# EAGLE design OBCI32_HC05 (EAGLE 7.4.0)
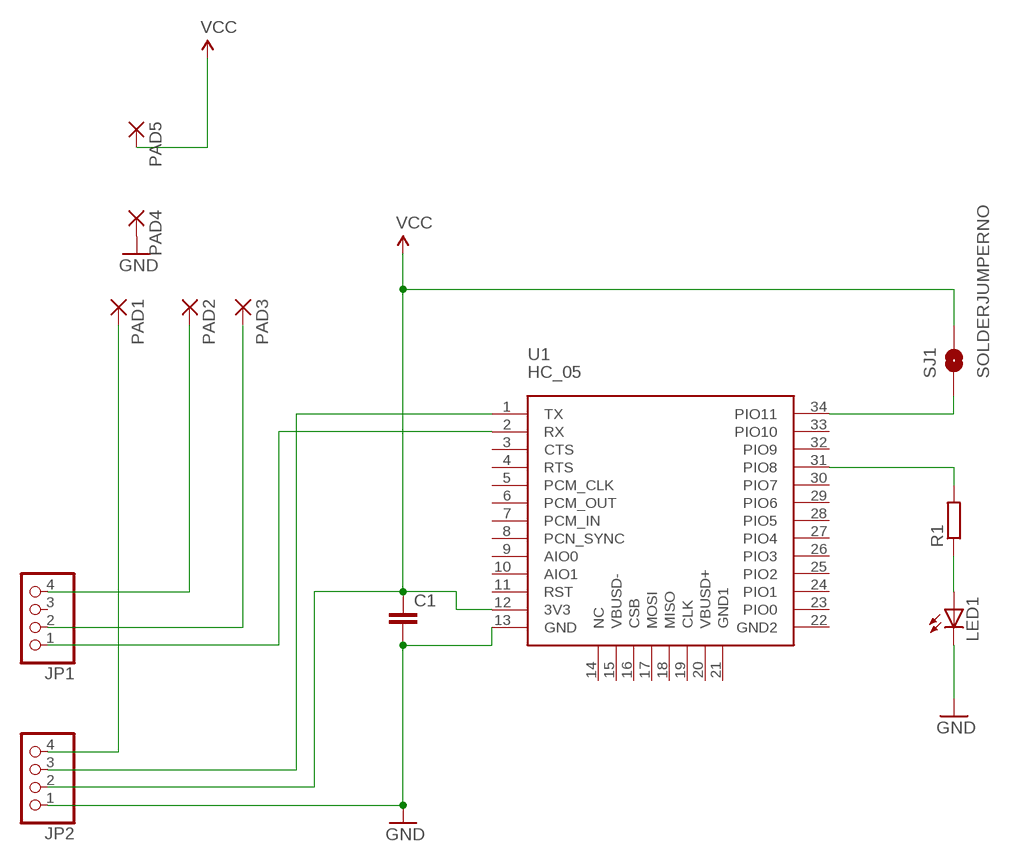
[diagram p0: schematic, sheet 1]

## Parts
C1  C-EUC0805  [C0805]
JP1  PINHD-1X4  [1X04]
JP2  PINHD-1X4  [1X04]
LED1  LEDCHIP-LED0805  [CHIP-LED0805]
PAD1  SMD2  [SMD1,27-2,54]
PAD2  SMD2  [SMD1,27-2,54]
PAD3  SMD2  [SMD1,27-2,54]
PAD4  SMD2  [SMD1,27-2,54]
PAD5  SMD2  [SMD1,27-2,54]
R1  R-EU_R0603  [R0603]
SJ1  SOLDERJUMPERNO  [SJ_2S-NO]
U1  HC_05  [BLUETOOTH_SMD]

## Nets
GND: C1.2 JP2.1 LED1.C PAD4.1(P) U1.13(GND)
N$1: LED1.A R1.1
N$3: JP2.3 U1.1(TX)
N$4: JP1.1 U1.2(RX)
N$5: R1.2 U1.31(PIO8)
N$6: SJ1.1 U1.34(PIO11)
N$7: JP1.2 PAD3.1(P)
N$8: JP1.4 PAD2.1(P)
N$9: JP2.4 PAD1.1(P)
VCC: C1.1 JP2.2 PAD5.1(P) SJ1.2 U1.12(3V3)
Unconnected: JP1.3 U1.3(CTS) U1.4(RTS) U1.5(PCM_CLK) U1.6(PCM_OUT) U1.7(PCM_IN) U1.8(PCN_SYNC) U1.9(AIO0) U1.10(AIO1) U1.11(RST) U1.14(NC) U1.15(VBUSD-) U1.16(CSB) U1.17(MOSI) U1.18(MISO) U1.19(CLK) U1.20(VBUSD+) U1.21(GND1) U1.22(GND2) U1.23(PIO0) U1.24(PIO1) U1.25(PIO2) U1.26(PIO3) U1.27(PIO4) U1.28(PIO5) U1.29(PIO6) U1.30(PIO7) U1.32(PIO9) U1.33(PIO10)

## Library data of the parts
C1 = rcl:C-EU: CAPACITOR, European symbol
JP1 JP2 = pinhead:PINHD-1X4: PIN HEADER
LED1 = adafruit:LED: LED OSRAM: - CHIPLED LG R971, LG N971, LY N971, LG Q971, LY Q971, LO R971, LY R971 LH N974, LH R974 LS Q976, LO Q976, LY Q976 LO Q996 - Hyper CHIPLED LW Q18S LB Q993, LB Q99A, LB R99A - SideLED LS A670, LO A670, LY A670, LG A670, LP A670 LB A673, LV A673, LT A673, LW A673 LH A674 LY A675 LS A676, LA A676, LO A676, LY A676, LW A676 LS A679, LY A679, LG A679 - Hyper Micro SIDELED® LS Y876, LA Y876, LO Y876, LY Y876 LT Y87S - SmartLED LW L88C, LW L88S LB L89C, LB L89S, LG L890 LS L89K, LO L89K, LY L89K LS L896, LA L896, LO L896, LY L896 - TOPLED LS T670, LO T670, LY T670, LG T670, LP T670 LSG T670, LSP T670, LSY T670, LOP T670, LYG T670 LG T671, LOG T671, LSG T671 LB T673, LV T673, LT T673, LW T673 LH T674 LS T676, LA T676, LO T676, LY T676, LB T676, LH T676, LSB T676, LW T676 LB T67C, LV T67C, LT T67C, LS T67K, LO T67K, LY T67K, LW E67C LS E67B, LA E67B, LO E67B, LY E67B, LB E67C, LV E67C, LT E67C LW T67C LS T679, LY T679, LG T679 LS T770, LO T770, LY T770, LG T770, LP T770 LB T773, LV T773, LT T773, LW T773 LH T774 LS E675, LA E675, LY E675, LS T675 LS T776, LA T776, LO T776, LY T776, LB T776 LHGB T686 LT T68C, LB T68C - Hyper Mini TOPLED® LB M676 - Mini TOPLED Santana® LG M470 LS M47K, LO M47K, LY M47K Source: http://www.osram.convergy.de/
PAD1-PAD5 = wirepad:SMD2: SMD PAD
R1 = rcl:R-EU_: RESISTOR, European symbol
SJ1 = SparkFun-Retired:SOLDERJUMPER: Solder Jumper Standard SMD solder jumper. Used to automate production. Two varients : Normally Open and Normally Closed are the same, but have different paste layers. NC will have a large amount of paste and should jumper during reflow.
U1 = SerialPortBluetooth:HC_05

## Board
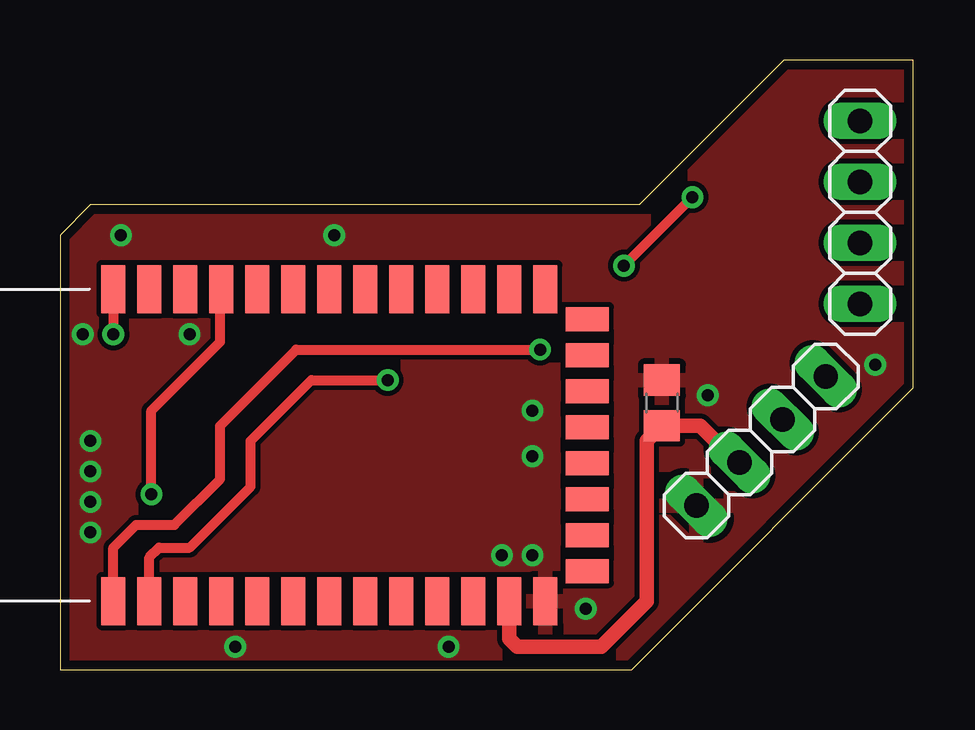
[diagram p1: board, top side]
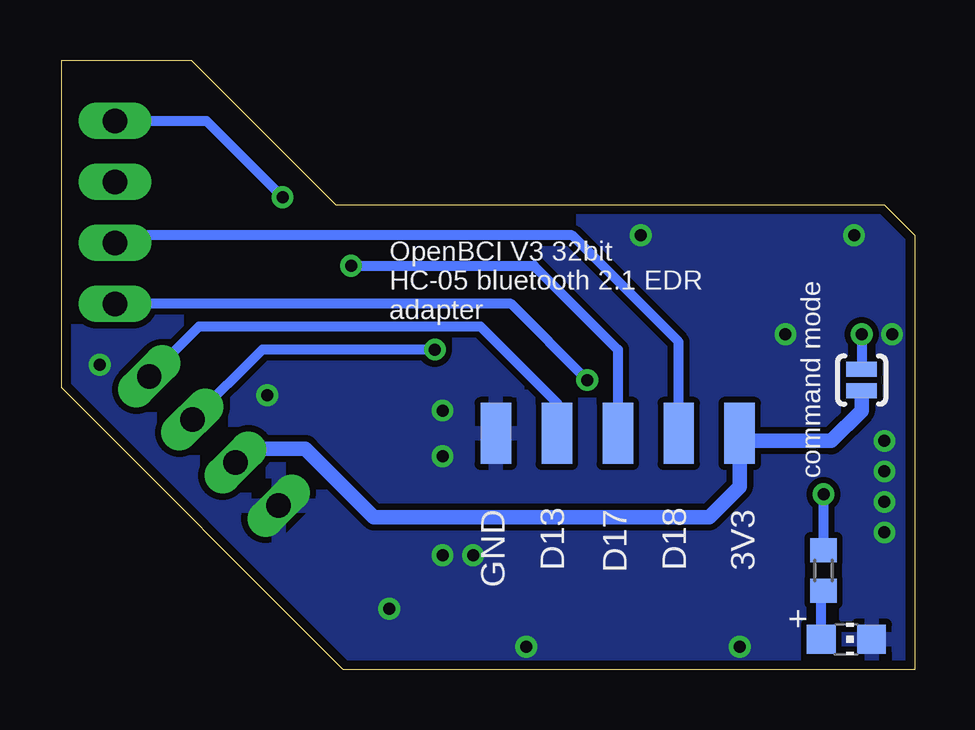
[diagram p2: board, bottom side, seen from below]

Size 35.56 x 25.4 mm. Coordinates in mm from the lower left corner, seen from the top.
Outline: 0,0 23.81,0 35.56,11.75 35.56,25.4 30.16,25.4 24.13,19.37 1.27,19.37 0,18.1 0,0
Copper layers (1*16): Top 0.035mm / dielectric 1.5mm / Bottom 0.035mm
Design rules "default *": minimum track width 10mil, minimum drill 24mil, track to track 8mil, track to pad 8mil, pad to pad 8mil, via to via 8mil, smd to smd 8mil, copper to edge 15mil, drill to drill 8mil, minimum pad ring 10mil, minimum via ring 8mil, stop-mask expansion 4mil, vias tented up to drill 20mil, thermal gap 10mil

### Footprints (pad centres in the part's own frame; a part is rotated, then mirrored left to right if it is on the bottom)
C0805 = smd 1.3 x 1.5: 1 -0.95,0; 2 0.95,0
1X04 = drill 1.016 long: 1 -3.81,0; 2 -1.27,0; 3 1.27,0; 4 3.81,0
CHIP-LED0805 = smd 1.2 x 1.2: A 0,-1.05; C 0,1.05
SMD1,27-2,54 = smd 1.27 x 2.54: 1 0,0
R0603 = smd 1 x 1.1: 1 -0.85,0; 2 0.85,0
SJ_2S-NO = smd 0.635 x 1.27: 1 -0.45,0; 2 0.45,0
BLUETOOTH_SMD = smd 2 x 1: 1 0,0; 2 0,-1.5; 3 0,-3; 4 0,-4.5; 5 0,-6; 6 0,-7.5; 7 0,-9; 8 0,-10.5; 9 0,-12; 10 0,-13.5; 11 0,-15; 12 0,-16.5; 13 0,-18; 22 13,-18; 23 13,-16.5; 24 13,-15; 25 13,-13.5; 26 13,-12; 27 13,-10.5; 28 13,-9; 29 13,-7.5; 30 13,-6; 31 13,-4.5; 32 13,-3; 33 13,-1.5; 34 13,0 | smd 1 x 1.8: 14 1.25,-19.75; 15 2.75,-19.75; 16 4.25,-19.75; 17 5.75,-19.75; 18 7.25,-19.75; 19 8.75,-19.75; 20 10.25,-19.75; 21 11.75,-19.75

### Placement (x,y rotation side)
C1  25.08,11.11 90 top
JP1  33.34,19.05 90 top
JP2  29.21,9.53 45 top
LED1  2.86,1.27 270 bottom
PAD1  14.92,9.84 0 bottom
PAD2  12.38,9.84 0 bottom
PAD3  9.84,9.84 0 bottom
PAD4  17.46,9.84 0 bottom
PAD5  7.3,9.84 0 bottom
R1  3.81,4.13 90 bottom
SJ1  2.22,12.07 270 bottom
U1  2.22,2.86 90 top

### Tracks (layer width: path | path; a pad name or v marks a point on that pad's centre or on a via)
GND  (via drill 0.5)
  other vias: 1.27,6.98 1.27,5.71 1.27,8.25 1.27,9.53 0.95,13.97 2.54,18.1 11.43,18.1 7.3,0.95 16.19,0.95 21.91,2.54 19.68,4.76 18.41,4.76 19.68,10.8 19.68,8.89 33.97,12.7 26.99,11.43 5.4,13.97
  pour Top: -0.32,27.94 -0.32,-5.08 40.96,-5.08 40.96,27.94
  pour Bottom (isolate 0.254): -0.32,26.67 -0.32,-2.54 38.42,-2.54 38.42,26.67
N$1
  Bottom 0.406: LED1.A 3.91,3.18 R1.1
N$3  (via drill 0.5)
  Top 0.406: U1.1 2.22,5.08 3.18,6.03 4.76,6.03 6.67,7.94 6.67,10.16 9.84,13.34 v20,13.34
  Bottom 0.406: v20,13.34 27.2,13.34 JP2.3
N$4  (via drill 0.5)
  Top 0.406: U1.2 3.72,4.68 4.13,5.08 5.4,5.08 7.94,7.62 7.94,9.53 10.48,12.07 v13.65,12.07
  Bottom 0.406: v13.65,12.07 16.83,15.24 JP1.1
N$5  (via drill 0.5)
  Top 0.406: v3.81,7.3 3.81,10.8 6.67,13.65 6.67,15.8 U1.31
  Bottom 0.406: R1.2 v3.81,7.3
N$6  (via drill 0.5)
  Top 0.406: U1.34 v2.22,13.97
  Bottom 0.406: v2.22,13.97 SJ1.1
N$7
  Bottom 0.406: PAD3.1 9.84,13.65 14.29,18.1 33.02,18.1 JP1.2
N$8  (via drill 0.5)
  Top 0.406: v26.35,19.69 v23.5,16.83
  Bottom 0.406: JP1.4 29.53,22.86 v26.35,19.69 | v23.5,16.83 15.87,16.83 12.38,13.34 PAD2.1
N$9
  Bottom 0.406: PAD1.1 14.92,11.11 18.1,14.29 29.84,14.29 JP2.4
VCC
  Top 0.61: JP2.2 28.2,8.63 26.67,10.16 C1.1 24.45,9.53 24.45,2.86 22.54,0.95 19.05,0.95 18.72,1.28 U1.12
  Bottom 0.61: SJ1.2 2.22,10.8 3.49,9.53 6.98,9.53 PAD5.1 7.3,7.62 8.57,6.35 22.54,6.35 25.4,9.21 27.73,9.21 JP2.2

### Text on the board
bPlace: command mode | OpenBCI V3 32bit / HC-05 bluetooth 2.1 EDR / adapter | D17 | GND | 3V3 | D18 | D13